# EAGLE design rx_1280 (EAGLE 9.6.2)
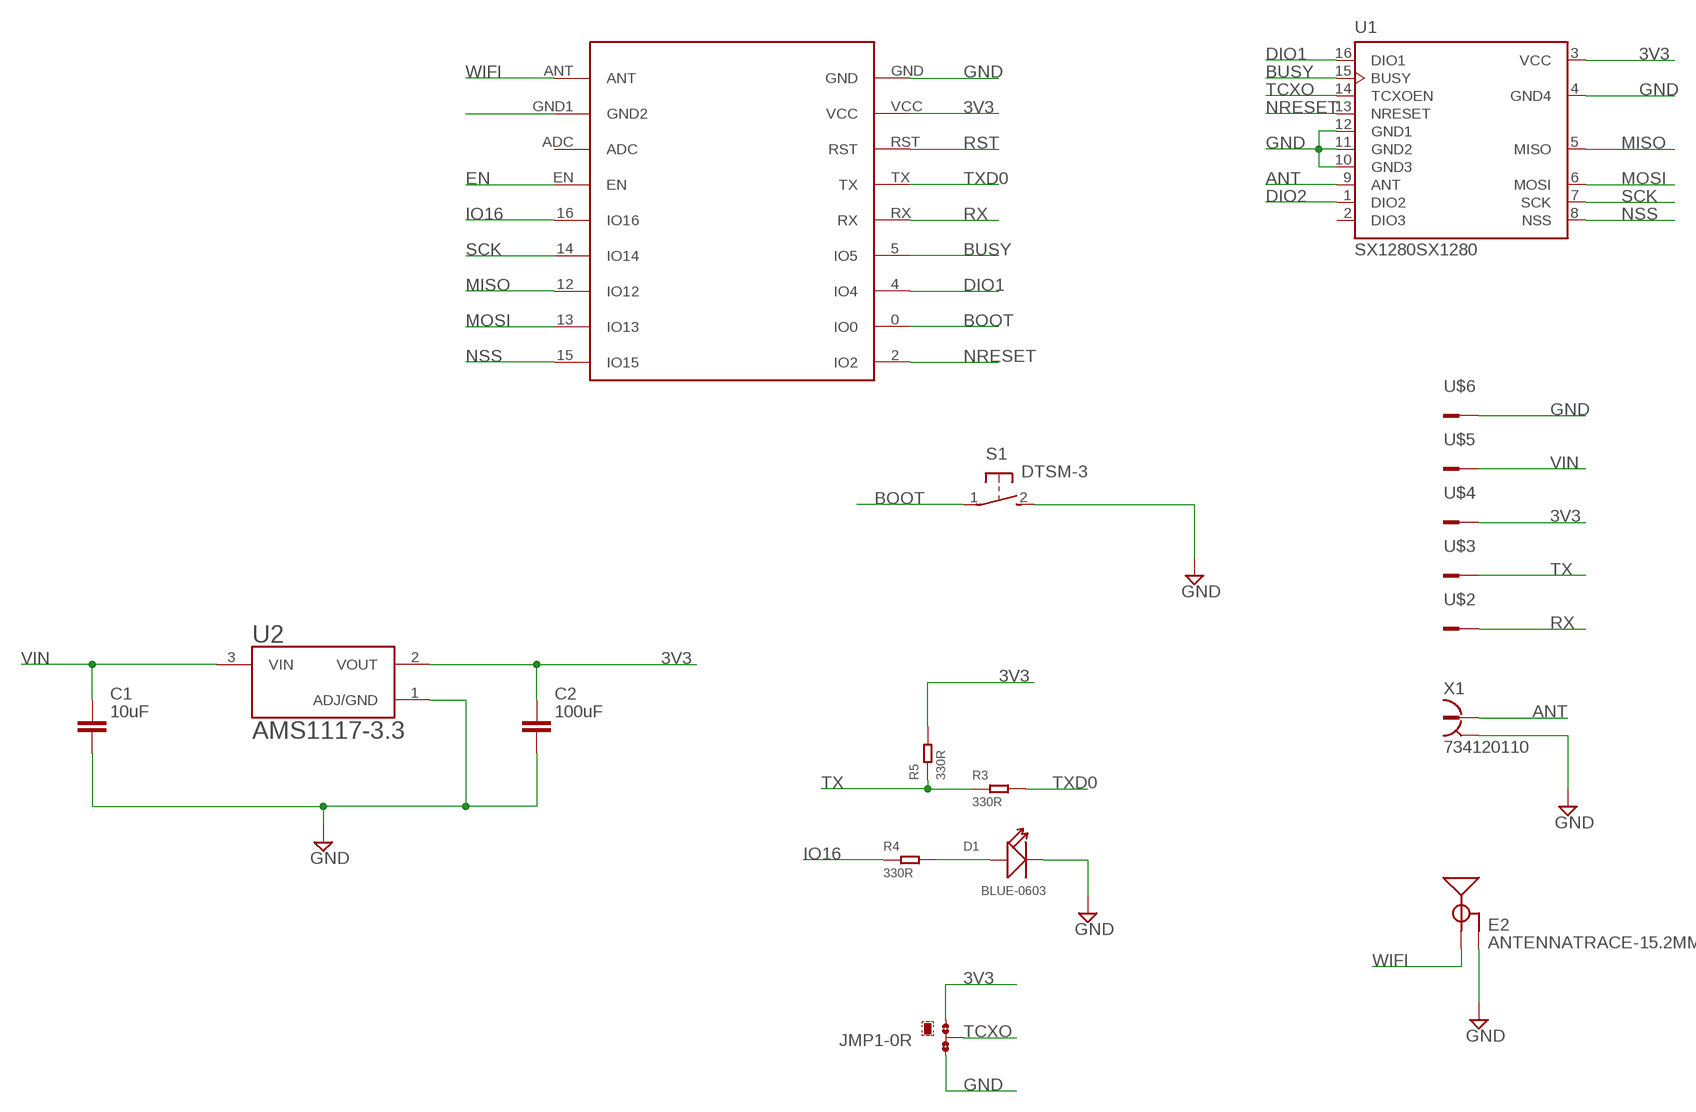
[diagram p0: schematic, sheet 1]

## Parts
C1  10uF  C_TANTALUM-1411(3528-METRIC)  [CAPM3528X210]
C2  100uF  C_TANTALUM-1411(3528-METRIC)  [CAPM3528X210]
D1  BLUE-0603  SMD-LED-CLEAR-BLUE(0603)  [LED-0603]
E2  ANTENNATRACE-15.2MM  [TRACE_ANTENNA_2.4GHZ_15.2MM]
JMP1  0R-JUMPA  [A0R-JMP]
R3  330R  SMD-RES-330R-5%-1/8W(0805)  [R0805]
R4  330R  SMD-RES-330R-5%-1/8W(0805)  [R0805]
R5  330R  SMD-RES-330R-5%-1/8W(0805)  [R0805]
S1  DTSM-3  [DTSM-3]
U1  SX1280SX1280  [SX1280]
U2  AMS1117-3.3  [SOT229P700X180-4N]
U$1  ESP-M2  [ESP-M2]
U$2  CONN-1  [PAD1]
U$3  CONN-1  [PAD1]
U$4  CONN-1  [PAD1]
U$5  CONN-1  [PAD1]
U$6  CONN-1  [PAD1]
X1  734120110  [734120110]

## Nets
3V3: C2.1 JMP1.1 R5.2 U1.3(VCC) U2.2(VOUT) U$1.VCC U$4.P$1
ANT: U1.9(ANT) X1.1
BOOT: S1.1 U$1.0(IO0)
BUSY: U1.15(BUSY) U$1.5(IO5)
DIO1: U1.16(DIO1) U$1.4(IO4)
DIO2: U1.1(DIO2)
EN: U$1.EN
GND: C1.2 C2.2 D1.- E2.GND JMP1.3 S1.2 U1.4(GND4) U1.10(GND3) U1.11(GND2) U1.12(GND1) U2.1(ADJ/GND) U$1.GND U$1.GND1(GND2) U$6.P$1 X1.S@1 X1.S@2 X1.S@3
IO16: R4.1 U$1.16(IO16)
MISO: U1.5(MISO) U$1.12(IO12)
MOSI: U1.6(MOSI) U$1.13(IO13)
N$1: D1.+ R4.2
NRESET: U1.13(NRESET) U$1.2(IO2)
NSS: U1.8(NSS) U$1.15(IO15)
RST: U$1.RST
RX: U$1.RX U$2.P$1
SCK: U1.7(SCK) U$1.14(IO14)
TCXO: JMP1.2 U1.14(TCXOEN)
TX: R3.1 R5.1 U$3.P$1
TXD0: R3.2 U$1.TX
VIN: C1.1 U2.3(VIN) U$5.P$1
WIFI: E2.ANT(SIGNAL) U$1.ANT
Unconnected: U1.2(DIO3) U$1.ADC

## Library data of the parts
C1 C2 = Capacitor:C: Capacitor - Generic; CATEGORY: Capacitor
D1 = OPL_Optoelectronics:SMD-LED-CLEAR-BLUE(0603): 304090045; MPN: 19-217-BHC-ZL1M2RY-3T
E2 = esp-ant:ANTENNA: Chip antenna Chip antenna with ground or secondary connection. Common with larger metal RF connectors.
JMP1 = jump-0r-smd:0R-JUMP: SMD 0R 0805 Jumper
R3-R5 = OPL_Resistor:SMD-RES-330R-5%-1/8W(0805): 301012196; MPN: RC0805JR-071KL; VALUE: 1K
S1 = switch-tact:DTSM-3
U1 = RFM95:SX1280: Mod Txrx Lora +20dbm 868mhz Smd
U2 = AMS1117-3.3:AMS1117-3.3: Sot223/Pkg 1-Amp 3.3-Volt Low Drop Out Voltage Regulatator; AVAILABILITY: Unavailable; DESCRIPTION: Sot223/Pkg 1-Amp 3.3-Volt Low Drop Out Voltage Regulatator; MF: Advanced Monolithic Systems; MP: AMS1117-3.3; PACKAGE: None; PRICE: None
U$1 = ESP-01F:ESP-M2: ESP8285 Module - M2; AVAILABILITY: Unavailable; DESCRIPTION: Wifi Module; MF: Doctors of Intelligence & Technology Co., LTD; MP: ESP-M2; PACKAGE: Package Analog Devices; PRICE: None
U$2-U$6 = wv-connector:CONN-1
X1 = u.fl:734120110: MICRO COAXIAL CONNECTOR RECEPTACLE VERTICAL Source: Data sheet <http://www.molex.com/pdm_docs/sd/734120110_sd.pdf>; AVAILABILITY: Unavailable; DESCRIPTION: U.FL _UMCC_ Connector Receptacle, Male Pin 50Ohm Surface Mount Solder; MF: Molex; MP: 734-12-0110; PACKAGE: None; PRICE: None

## Board
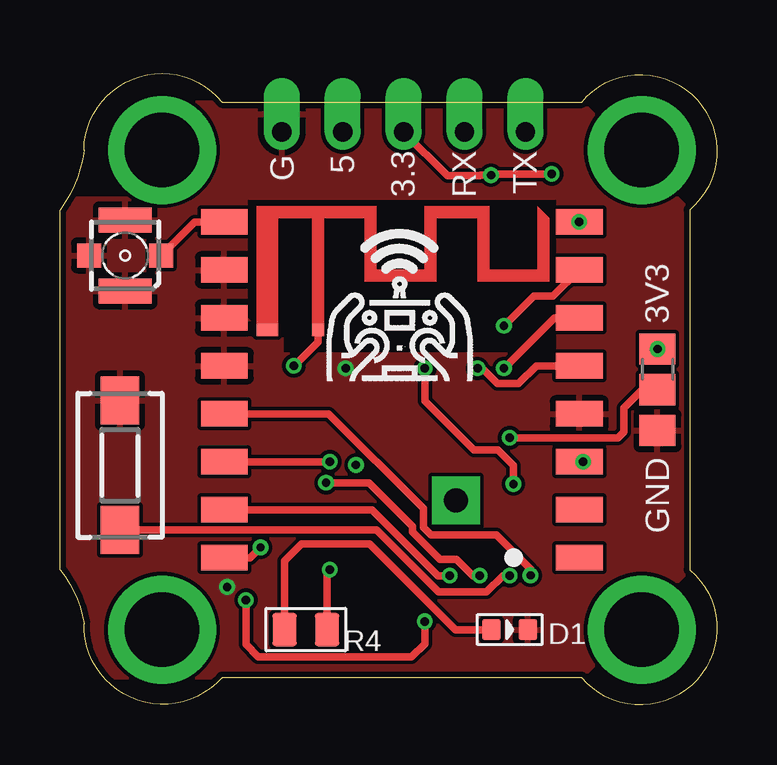
[diagram p1: board, top side]
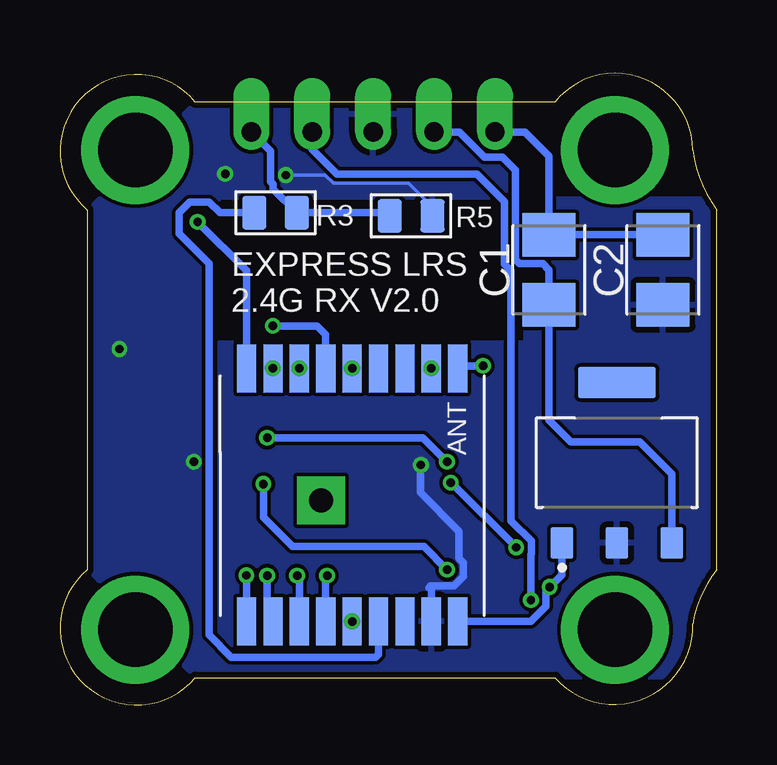
[diagram p2: board, bottom side, seen from below]

Size 27.39 x 26.33 mm. Coordinates in mm from the lower left corner, seen from the top.
Outline: 6.75,25.14 21.75,25.14 arc-190 26.25,20.64 26.25,5.64 arc-190 21.75,1.14 6.75,1.14 arc-140 1,3.39 arc30 0,5.64 0,20.64 arc30 1,23.14 arc-140 6.75,25.14
Copper layers (1*16): Top 0.035mm / dielectric 1.5mm / Bottom 0.035mm
Design rules "SeeedStudio_2layer_DRU_no_angle_20140221": minimum track width 6mil, minimum drill 12mil, track to track 6mil, track to pad 6mil, pad to pad 6mil, via to via 6mil, smd to smd 0mil, copper to edge 10mil, drill to drill 10mil, minimum pad ring 10mil, minimum via ring 6mil, stop-mask expansion 2mil, vias tented up to drill 100mil, thermal gap 10mil

### Footprints (pad centres in the part's own frame; a part is rotated, then mirrored left to right if it is on the bottom)
CAPM3528X210 = smd 1.796 x 2.204: 1 -1.46,0; 2 1.46,0
LED-0603 = smd 0.762 x 0.889: + -0.762,0; - 0.762,0
TRACE_ANTENNA_2.4GHZ_15.2MM = smd 0.5 x 0.5: ANT 0,-0.25 | smd 0.9 x 0.5: GND -2.1,-0.25
A0R-JMP = smd 1.5 x 1.3: 1 0,1.7; 2 0,0; 3 0,-1.7
R0805 = smd 1.397 x 1.016: 1 0,0.889; 2 0,-0.889
DTSM-3 = smd 2 x 1.6: 1 -2.7,0; 2 2.7,0
SX1280 = smd 1.95 x 1.05: 1 -7.4,7; 2 -7.4,5; 3 -7.4,3; 4 -7.4,1; 5 -7.4,-1; 6 -7.4,-3; 7 -7.4,-5; 8 -7.4,-7; 9 7.4,-7; 10 7.4,-5; 11 7.4,-3; 12 7.4,-1; 13 7.4,1; 14 7.4,3; 15 7.4,5; 16 7.4,7
SOT229P700X180-4N = smd 0.93 x 1.31: 1 -2.29,-3.345; 2 0,-3.345; 3 2.29,-3.345 | smd 3.24 x 1.31: 4 0,3.345
ESP-M2 = smd 2 x 0.8: 0 5.25,-8.8; 2 5.25,-9.9; 4 5.25,-7.7; 5 5.25,-6.6; 12 -5.3,-7.7; 13 -5.3,-8.8; 14 -5.3,-6.6; 15 -5.3,-9.9; 16 -5.3,-5.5; ADC -5.3,-3.3; ANT -5.3,-1.1; EN -5.3,-4.4; GND -5.3,-2.2; GND1 5.25,-1.1; RST 5.25,-3.3; RX 5.25,-5.5; TX 5.25,-4.4; VCC 5.25,-2.2 | drill 1 pad 2 square: P$1 0.2,-6.8
PAD1 = drill 0.8 pad 1.5 offset: P$1 0,0
734120110 = smd 1 x 1: 1 0,-1.5; S@1 0,1.5 | smd 1.05 x 2.2: S@2 -1.475,0; S@3 1.475,0

### Placement (x,y rotation side)
C1  7,18.14 90 bottom
C2  2.25,18.14 90 bottom
D1  18.75,3.14 0 top
E2  10.75,15.89 0 top
JMP1  24.91,13.14 0 top
R3  18.4,20.52 270 bottom
R4  10.25,3.14 270 top
R5  12.75,20.39 90 bottom
S1  2.5,9.99 90 top
U1  14.25,13.14 180 top
U2  4.17,10.1 0 bottom
U$1  9.71,8.73 270 bottom
U$2  16.87,23.89 90 top
U$3  19.41,23.89 90 top
U$4  14.33,23.89 90 top
U$5  11.79,23.89 90 top
U$6  9.25,23.89 90 top
X1  2.71,18.74 90 top

### Tracks (layer width: path | path; a pad name or v marks a point on that pad's centre or on a via)
3V3  (via drill 0.35)
  Top 0.305: U$4.P$1 16.16,22.06 17.51,22.06 17.53,22.09 v17.97,22.09 18.02,22.14 v20.5,22.14 | v21.81,10.14 U1.3
  Bottom 0.152: R5.2 11.86,20.75 12.86,21.74 15.99,21.74 16.33,22.09 v17.97,22.09
  Bottom 0.305: U$1.VCC 11.91,4.8 12,4.89 11.93,4.96 10.97,4.96 10.57,5.36 10.57,5.92 10.75,6.11 10.75,7.24 12.37,8.86 12.37,9.98 v12.34,10.01
  other vias: 24.91,14.84
  pour Bottom: -0.25,21.14 3.75,25.14 3.75,25.39 4,25.14 21.75,25.14 26.25,20.64 26.25,5.64 21.75,1.14 20.75,1.14 20.75,21.14
  pour Bottom: -0.25,21.14 -0.25,3.39 0,3.14 2,1.14 20.75,1.14 20.75,15.14 8,15.14 8,21.14
ANT
  Top 0.305: U1.9 5.62,20.14 X1.1
BOOT  (via drill 0.35)
  Top 0.305: S1.1 13.2,7.29 15.79,4.71 17.78,4.71 18.47,5.39 v18.75,5.39
  Bottom 0.305: v18.75,5.39 18.75,3.72 U$1.0
BUSY  (via drill 0.35)
  Top 0.305: v16.25,5.39 15.75,5.39 13,8.14 U1.15
  Bottom 0.305: v16.25,5.39 16.31,5.33 U$1.5
DIO1  (via drill 0.35)
  Top 0.305: v17.5,5.39 17.22,5.39 16.53,6.07 15.83,6.07 14.7,7.2 14.7,7.44 12.88,9.26 v11.09,9.26 | U1.16 7.94,6.14 v8.37,6.57
  Bottom 0.305: U$1.4 17.41,5.3 v17.5,5.39 | v8.37,6.57 11.06,9.26 v11.09,9.26
GND  (via drill 0.35)
  Bottom 0.305: C2.2 C1.2 7,22.89 8,23.89 U$6.P$1 | U2.1 6.46,5.43 v6.97,4.92 7.12,4.76 7.12,4.11 7.75,3.48 U$1.GND1
  other vias: 11.91,14.03
  pour Top: -0.25,21.14 20.75,21.14 20.75,1.14 21.75,1.14 26.25,5.64 26.25,20.64 21.75,25.14 6.75,25.14 3.75,25.14
  pour Top: 7.75,21.14 7.75,16.14 8,15.89 9.25,15.89 9.25,14.64 20.75,14.64 20.75,1.14 2,1.14 0,3.14 0,20.64 0.5,21.14
IO16  (via drill 0.35)
  Top 0.305: R4.1 11.14,5.53 v11.25,5.64 | U$1.16 15.21,12.68 17.25,10.64 18.25,10.64 18.91,9.98 v18.91,9.21
  Bottom 0.305: v11.25,5.64 12.22,6.61 17.7,6.61 18.91,7.81 v18.91,9.21
  other vias: 15.21,14.03
MISO  (via drill 0.35)
  Top 0.305: U$1.12 17.62,14.03 18.25,13.4 19.12,13.4 19.86,14.14 U1.5
  other vias: 17.41,14.03
MOSI  (via drill 0.35)
  Top 0.305: U$1.13 20.62,16.14 U1.6
  other vias: 18.51,14.03
N$1
  Top 0.305: R4.2 9.36,6 10.08,6.72 12.91,6.72 16.49,3.14 D1.+
N$2  (via drill 3.1 pad 4.5)
  other vias: 4.25,3.14
N$3  (via drill 3.1 pad 4.5)
  other vias: 4.25,23.14
N$4  (via drill 3.1 pad 4.5)
  other vias: 24.25,3.14
N$5  (via drill 3.1 pad 4.5)
  other vias: 24.25,23.14
NRESET  (via drill 0.35)
  Top 0.305: U1.13 11.2,12.14 15.16,8.18 15.16,7.39 15.46,7.09 18.2,7.09 19.62,5.67 v19.62,5.4
  Bottom 0.305: v19.62,5.4 U$1.2
NSS  (via drill 0.35)
  Bottom 0.305: U$1.15 19.61,18.1 U1.8
  other vias: 21.65,20.14
RX  (via drill 0.35)
  Top 0.305: v7.75,4.37 7.75,2.52 8.26,2.01 14.66,2.01 15.21,2.56 U$1.RX
  Bottom 0.305: v7.75,4.37 7.75,6.28 7.73,6.31 7.73,6.83 8.58,7.68 8.58,18.1 8.86,18.39 8.86,20.99 10,22.13 15.83,22.13 16.87,23.16 U$2.P$1
  other vias: 15.21,3.48
SCK  (via drill 0.35)
  Top 0.305: v18.51,15.8 19.76,17.05 20.56,17.05 U1.7
  Bottom 0.305: U$1.14 16.31,15.44 16.67,15.8 v18.51,15.8
TCXO  (via drill 0.35)
  Top 0.305: v18.75,11.14 23.25,11.14 23.5,11.39 23.5,12.39 24.25,13.14 JMP1.2 | U1.14 v11.25,10.14
  Bottom 0.305: v11.25,10.14 12.25,11.14 v18.75,11.14
TX
  Bottom 0.305: R5.1 13.77,20.52 R3.1 18.5,21.51 18.5,21.72 18.6,21.83 18.6,23.08 U$3.P$1
TXD0
  Bottom 0.305: R3.2 20.72,20.52 21.17,20.97 21.98,20.97 22.42,20.53 22.42,19.65 21.18,18.4 21.18,2.91 20.25,1.98 14.23,1.98 14.11,2.11 U$1.TX
VIN
  Bottom 0.305: U$5.P$1 10.74,23.89 9.69,22.83 8.95,22.83 8.41,22.3 8.41,18.58 8.23,18.4 7.26,18.4 7,18.14 C1.1 7,11.87 6.09,10.96 3.21,10.96 1.88,9.63 U2.3
WIFI  (via drill 0.35)
  Top 0.305: E2.ANT 10.75,15.14 v9.75,14.14
  Bottom 0.305: v9.75,14.14 10.7,14.14 U$1.ANT

### Text on the board
tNames: G | 5 | 3.3 | RX | TX | 3V3 | GND
bNames: EXPRESS LRS / 2.4G RX V2.0 | ANT